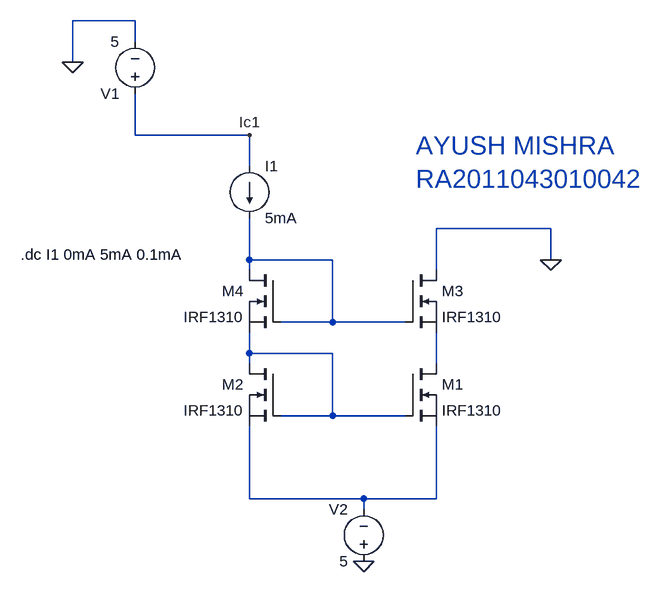
[diagram p0: schematic exp_12_cascode.asc]
exp_12_cascode.asc, the LTspice schematic file:
Version 4
SHEET 1 880 704
WIRE -64 -176 -160 -176
WIRE -64 -144 -64 -176
WIRE -160 -112 -160 -176
WIRE -64 0 -64 -64
WIRE 112 0 -64 0
WIRE 112 48 112 0
WIRE 576 144 400 144
WIRE 112 192 112 128
WIRE 240 192 112 192
WIRE 576 192 576 144
WIRE 112 208 112 192
WIRE 400 208 400 144
WIRE 240 288 240 192
WIRE 240 288 160 288
WIRE 352 288 240 288
WIRE 112 336 112 304
WIRE 240 336 112 336
WIRE 112 352 112 336
WIRE 400 352 400 304
WIRE 240 432 240 336
WIRE 240 432 160 432
WIRE 352 432 240 432
WIRE 112 560 112 448
WIRE 288 560 112 560
WIRE 400 560 400 448
WIRE 400 560 288 560
WIRE 288 576 288 560
FLAG -160 -112 0
FLAG 576 192 0
FLAG 288 656 0
FLAG 112 0 Ic1
SYMBOL current 112 48 R0
WINDOW 123 0 0 Left 0
WINDOW 39 0 0 Left 0
SYMATTR InstName I1
SYMATTR Value 5mA
SYMBOL voltage -64 -48 R180
WINDOW 123 0 0 Left 0
WINDOW 39 0 0 Left 0
SYMATTR InstName V1
SYMATTR Value 5
SYMBOL voltage 288 672 R180
WINDOW 0 24 96 Left 2
WINDOW 3 24 16 Left 2
WINDOW 123 0 0 Left 0
WINDOW 39 0 0 Left 0
SYMATTR InstName V2
SYMATTR Value 5
SYMBOL nmos 352 352 R0
SYMATTR InstName M1
SYMATTR Value IRF1310
SYMBOL nmos 160 352 M0
SYMATTR InstName M2
SYMATTR Value IRF1310
SYMBOL nmos 352 208 R0
SYMATTR InstName M3
SYMATTR Value IRF1310
SYMBOL nmos 160 208 M0
SYMATTR InstName M4
SYMATTR Value IRF1310
TEXT -240 184 Left 2 !.dc I1 0mA 5mA 0.1mA
TEXT 368 16 Left 4 ;AYUSH MISHRA\nRA2011043010042

The netlist it stands for:
* exp_12_cascode.asc
I1 Ic1 N001 5mA
V1 Ic1 0 5
V2 0 N004 5
M1 N003 N002 N004 N004 IRF1310
M2 N002 N002 N004 N004 IRF1310
M3 0 N001 N003 N003 IRF1310
M4 N001 N001 N002 N002 IRF1310
.model NMOS NMOS
.model PMOS PMOS
.lib standard.mos
.dc I1 0mA 5mA 0.1mA
* AYUSH MISHRA
* RA2011043010042
.backanno
.end